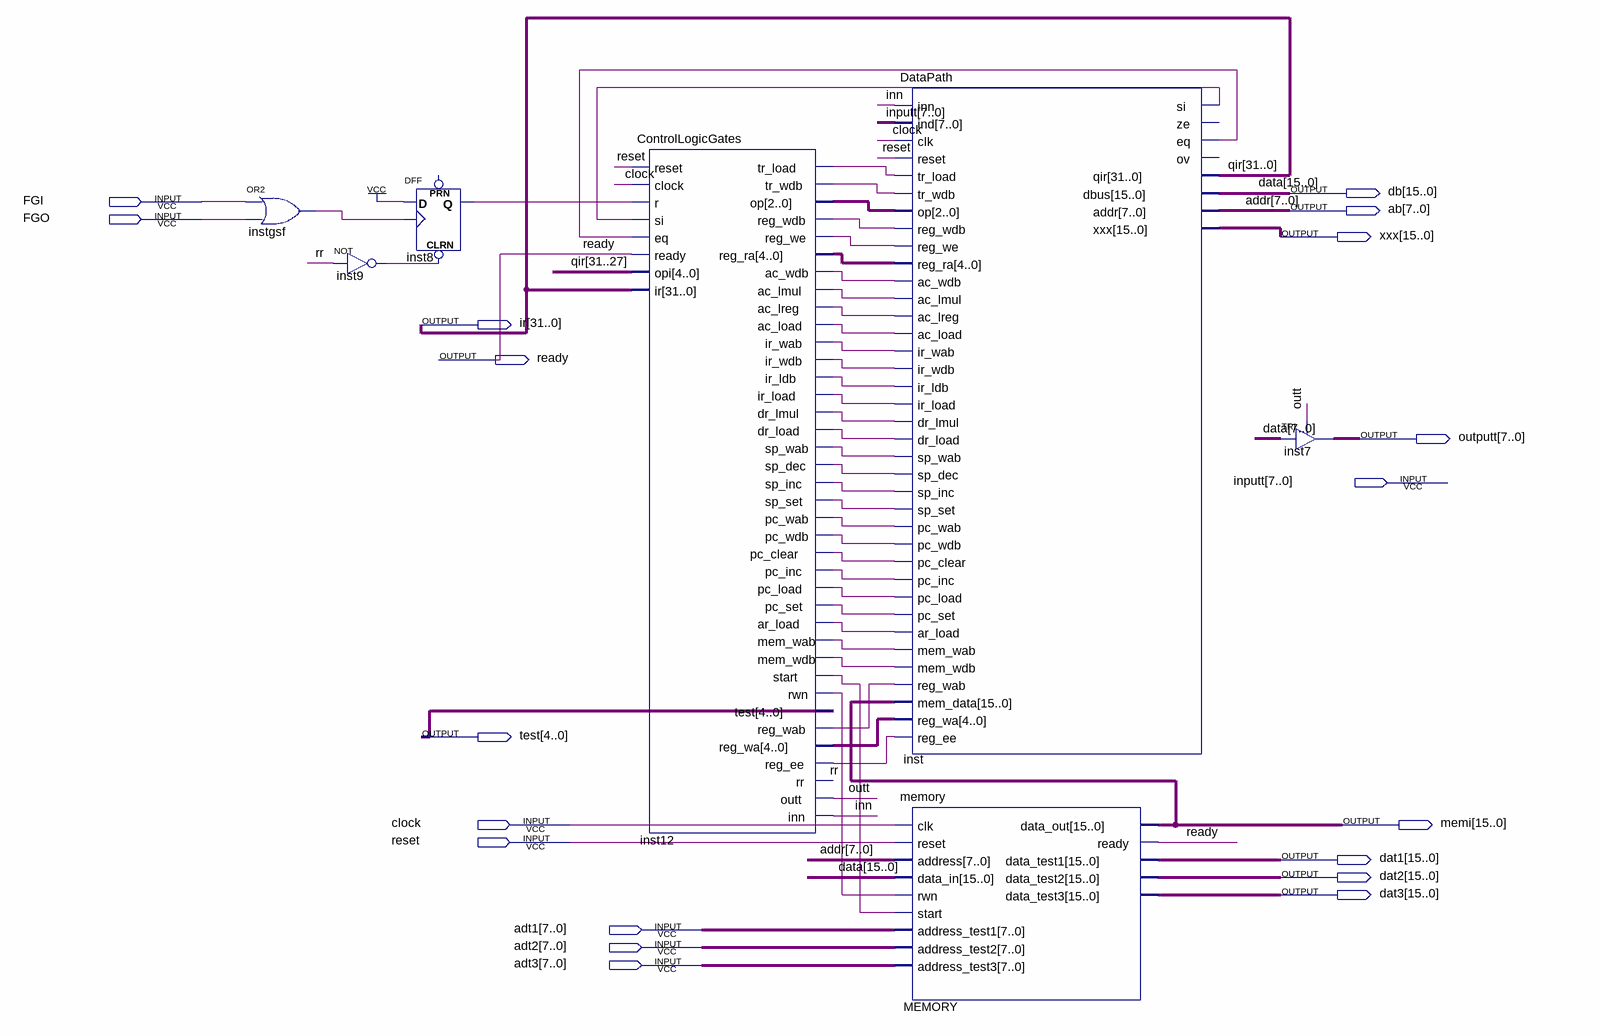
[diagram p0: schematic sheet]
// Quartus schematic cpu.bdf as structural Verilog: 7 symbols, 19 pins
module cpu (
  input  FGI,
  input  FGO,
  input  [7:0] inputt,
  input  clock,
  input  reset,
  input  [7:0] adt1,
  input  [7:0] adt2,
  input  [7:0] adt3,
  output [15:0] db,
  output [7:0] ab,
  output [15:0] xxx,
  output [31:0] ir,
  output ready,
  output [7:0] outputt,
  output [4:0] test,
  output [15:0] memi,
  output [15:0] dat1,
  output [15:0] dat2,
  output [15:0] dat3
);

  wire inn, inst8_q, inst9_out, inst12_ac_lmul, inst12_ac_load, inst12_ac_lreg, inst12_ac_wdb,
       inst12_ar_load, inst12_dr_lmul, inst12_dr_load, inst12_ir_ldb, inst12_ir_load, inst12_ir_wab,
       inst12_ir_wdb, inst12_mem_wab, inst12_mem_wdb, inst12_pc_clear, inst12_pc_inc, inst12_pc_load,
       inst12_pc_set, inst12_pc_wab, inst12_pc_wdb, inst12_reg_ee, inst12_reg_wab, inst12_reg_wdb,
       inst12_reg_we, inst12_rwn, inst12_sp_dec, inst12_sp_inc, inst12_sp_set, inst12_sp_wab, inst12_start,
       inst12_tr_load, inst12_tr_wdb, inst_eq, inst_si, instgsf_out, outt, rr;
  wire [2:0] inst12_op;
  wire [4:0] inst12_reg_ra, inst12_reg_wa;

  or instgsf (instgsf_out, FGI, FGO);
  not inst9 (inst9_out, rr);
  DFF inst8 (.CLRN(inst9_out), .CLK(instgsf_out), .D(1'b1), .Q(inst8_q));  // open: PRN
  ControlLogicGates inst12 (
    .reset(reset), .clock(clock), .r(inst8_q), .si(inst_si), .eq(inst_eq), .ready(ready), .opi(ir[31:27]),
    .ir(ir), .tr_load(inst12_tr_load), .tr_wdb(inst12_tr_wdb), .op(inst12_op), .reg_wdb(inst12_reg_wdb),
    .reg_we(inst12_reg_we), .reg_ra(inst12_reg_ra), .ac_wdb(inst12_ac_wdb), .ac_lmul(inst12_ac_lmul),
    .ac_lreg(inst12_ac_lreg), .ac_load(inst12_ac_load), .ir_wab(inst12_ir_wab), .ir_wdb(inst12_ir_wdb),
    .ir_ldb(inst12_ir_ldb), .ir_load(inst12_ir_load), .dr_lmul(inst12_dr_lmul), .dr_load(inst12_dr_load),
    .sp_wab(inst12_sp_wab), .sp_dec(inst12_sp_dec), .sp_inc(inst12_sp_inc), .sp_set(inst12_sp_set),
    .pc_wab(inst12_pc_wab), .pc_wdb(inst12_pc_wdb), .pc_clear(inst12_pc_clear), .pc_inc(inst12_pc_inc),
    .pc_load(inst12_pc_load), .pc_set(inst12_pc_set), .ar_load(inst12_ar_load), .mem_wab(inst12_mem_wab),
    .mem_wdb(inst12_mem_wdb), .start(inst12_start), .rwn(inst12_rwn), .test(test), .reg_wab(inst12_reg_wab),
    .reg_wa(inst12_reg_wa), .reg_ee(inst12_reg_ee), .rr(rr), .outt(outt), .inn(inn));
  DataPath inst (
    .inn(inn), .ind(inputt), .clk(clock), .reset(reset), .tr_load(inst12_tr_load), .tr_wdb(inst12_tr_wdb),
    .op(inst12_op), .reg_wdb(inst12_reg_wdb), .reg_we(inst12_reg_we), .reg_ra(inst12_reg_ra),
    .ac_wdb(inst12_ac_wdb), .ac_lmul(inst12_ac_lmul), .ac_lreg(inst12_ac_lreg), .ac_load(inst12_ac_load),
    .ir_wab(inst12_ir_wab), .ir_wdb(inst12_ir_wdb), .ir_ldb(inst12_ir_ldb), .ir_load(inst12_ir_load),
    .dr_lmul(inst12_dr_lmul), .dr_load(inst12_dr_load), .sp_wab(inst12_sp_wab), .sp_dec(inst12_sp_dec),
    .sp_inc(inst12_sp_inc), .sp_set(inst12_sp_set), .pc_wab(inst12_pc_wab), .pc_wdb(inst12_pc_wdb),
    .pc_clear(inst12_pc_clear), .pc_inc(inst12_pc_inc), .pc_load(inst12_pc_load), .pc_set(inst12_pc_set),
    .ar_load(inst12_ar_load), .mem_wab(inst12_mem_wab), .mem_wdb(inst12_mem_wdb), .reg_wab(inst12_reg_wab),
    .mem_data(memi), .reg_wa(inst12_reg_wa), .reg_ee(inst12_reg_ee), .si(inst_si), .eq(inst_eq), .qir(ir),
    .dbus(db), .addr(ab), .xxx(xxx));  // open: ze, ov
  memory MEMORY (
    .clk(clock), .reset(reset), .address(ab), .data_in(db), .rwn(inst12_rwn), .start(inst12_start),
    .address_test1(adt1), .address_test2(adt2), .address_test3(adt3), .data_out(memi), .ready(ready),
    .data_test1(dat1), .data_test2(dat2), .data_test3(dat3));
  TRI inst7[7:0] (.IN(db[7:0]), .OE(outt), .OUT(outputt));

  // Other names for the same wires on the sheet: addr[7:0] = ab; data[15:0] = db; qir[31:0] = ir
endmodule
